# Altium schematic sheet ShiftregisterTeil1.SchDoc
size A4
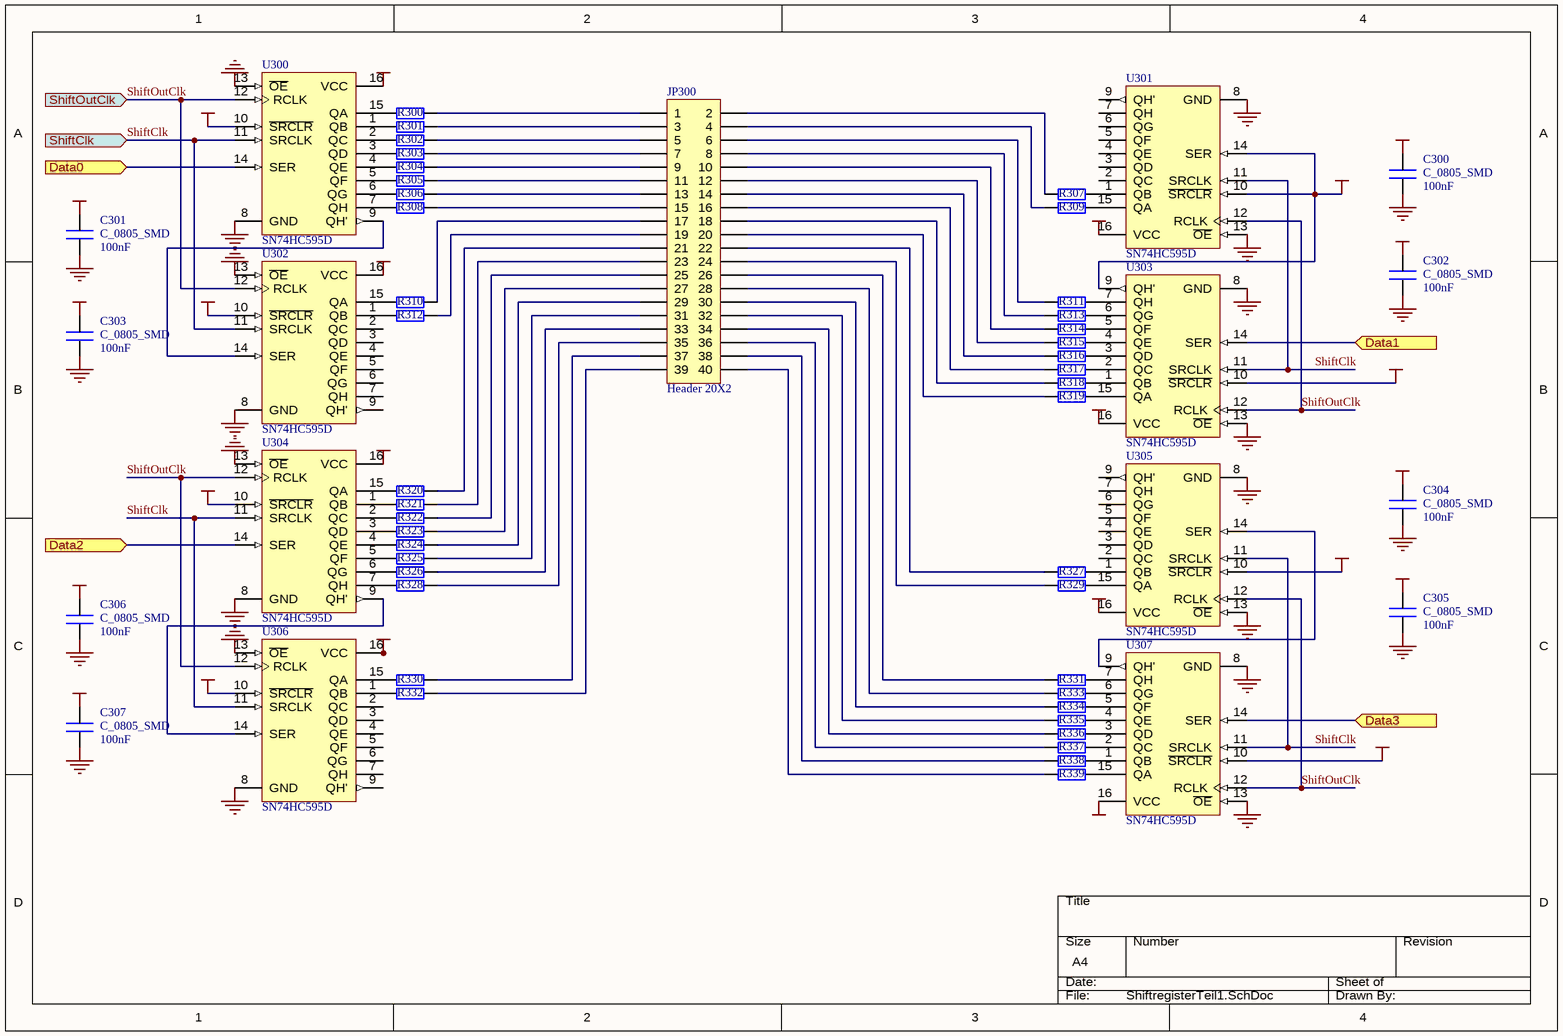
[diagram p0: ShiftregisterTeil1.SchDoc]

## Parts
C300  C_0805_SMD  [0805_R]
C301  C_0805_SMD  [0805_R]
C302  C_0805_SMD  [0805_R]
C303  C_0805_SMD  [0805_R]
C304  C_0805_SMD  [0805_R]
C305  C_0805_SMD  [0805_R]
C306  C_0805_SMD  [0805_R]
C307  C_0805_SMD  [0805_R]
JP300  Header 20X2  [HDR2X20]
R300  PullUp  [CR2012-0805]  (value not drawn)
R301  PullUp  [CR2012-0805]  (value not drawn)
R302  PullUp  [CR2012-0805]  (value not drawn)
R303  PullUp  [CR2012-0805]  (value not drawn)
R304  PullUp  [CR2012-0805]  (value not drawn)
R305  PullUp  [CR2012-0805]  (value not drawn)
R306  PullUp  [CR2012-0805]  (value not drawn)
R307  PullUp  [CR2012-0805]  (value not drawn)
R308  PullUp  [CR2012-0805]  (value not drawn)
R309  PullUp  [CR2012-0805]  (value not drawn)
R310  PullUp  [CR2012-0805]  (value not drawn)
R311  PullUp  [CR2012-0805]  (value not drawn)
R312  PullUp  [CR2012-0805]  (value not drawn)
R313  PullUp  [CR2012-0805]  (value not drawn)
R314  PullUp  [CR2012-0805]  (value not drawn)
R315  PullUp  [CR2012-0805]  (value not drawn)
R316  PullUp  [CR2012-0805]  (value not drawn)
R317  PullUp  [CR2012-0805]  (value not drawn)
R318  PullUp  [CR2012-0805]  (value not drawn)
R319  PullUp  [CR2012-0805]  (value not drawn)
R320  PullUp  [CR2012-0805]  (value not drawn)
R321  PullUp  [CR2012-0805]  (value not drawn)
R322  PullUp  [CR2012-0805]  (value not drawn)
R323  PullUp  [CR2012-0805]  (value not drawn)
R324  PullUp  [CR2012-0805]  (value not drawn)
R325  PullUp  [CR2012-0805]  (value not drawn)
R326  PullUp  [CR2012-0805]  (value not drawn)
R327  PullUp  [CR2012-0805]  (value not drawn)
R328  PullUp  [CR2012-0805]  (value not drawn)
R329  PullUp  [CR2012-0805]  (value not drawn)
R330  PullUp  [CR2012-0805]  (value not drawn)
R331  PullUp  [CR2012-0805]  (value not drawn)
R332  PullUp  [CR2012-0805]  (value not drawn)
R333  PullUp  [CR2012-0805]  (value not drawn)
R334  PullUp  [CR2012-0805]  (value not drawn)
R335  PullUp  [CR2012-0805]  (value not drawn)
R336  PullUp  [CR2012-0805]  (value not drawn)
R337  PullUp  [CR2012-0805]  (value not drawn)
R338  PullUp  [CR2012-0805]  (value not drawn)
R339  PullUp  [CR2012-0805]  (value not drawn)
U300  SN74HC595D  [D016]
U301  SN74HC595D  [D016]
U302  SN74HC595D  [D016]
U303  SN74HC595D  [D016]
U304  SN74HC595D  [D016]
U305  SN74HC595D  [D016]
U306  SN74HC595D  [D016]
U307  SN74HC595D  [D016]

## Ports
Data0 (in), Data1 (in), Data2 (in), Data3 (in), ShiftClk (in), ShiftOutClk (in)

## Nets
GND: C300.1 C301.1 C302.1 C303.1 C304.1 C305.1 C306.1 C307.1 U300.8(GND) U300.13(~{OE}) U301.8(GND) U301.13(~{OE}) U302.8(GND) U302.13(~{OE}) U303.8(GND) U303.13(~{OE}) U304.8(GND) U304.13(~{OE}) U305.8(GND) U305.13(~{OE}) U306.8(GND) U306.13(~{OE}) U307.8(GND) U307.13(~{OE})
VCC: C300.2 C301.2 C302.2 C303.2 C304.2 C305.2 C306.2 C307.2 U300.10(~{SRCLR}) U300.16(VCC) U301.10(~{SRCLR}) U301.14(SER) U301.16(VCC) U302.10(~{SRCLR}) U302.16(VCC) U303.9(QH') U303.10(~{SRCLR}) U303.16(VCC) U304.10(~{SRCLR}) U304.16(VCC) U305.10(~{SRCLR}) U305.16(VCC) U306.10(~{SRCLR}) U306.16(VCC) U307.10(~{SRCLR}) U307.16(VCC)
Data0: U300.14(SER) ; port Data0
Data1: U303.14(SER) ; port Data1
Data2: U304.14(SER) ; port Data2
Data3: U307.14(SER) ; port Data3
ShiftClk: U300.11(SRCLK) U301.11(SRCLK) U302.11(SRCLK) U303.11(SRCLK) U304.11(SRCLK) U305.11(SRCLK) U306.11(SRCLK) U307.11(SRCLK) ; port ShiftClk
ShiftOutClk: U300.12(RCLK) U301.12(RCLK) U302.12(RCLK) U303.12(RCLK) U304.12(RCLK) U305.12(RCLK) U306.12(RCLK) U307.12(RCLK) ; port ShiftOutClk
NetJP300_1: JP300.1 R300.1
NetJP300_2: JP300.2 R307.2
NetJP300_3: JP300.3 R301.1
NetJP300_4: JP300.4 R309.2
NetJP300_5: JP300.5 R302.1
NetJP300_6: JP300.6 R311.2
NetJP300_7: JP300.7 R303.1
NetJP300_8: JP300.8 R313.2
NetJP300_9: JP300.9 R304.1
NetJP300_10: JP300.10 R314.2
NetJP300_11: JP300.11 R305.1
NetJP300_12: JP300.12 R315.2
NetJP300_13: JP300.13 R306.1
NetJP300_14: JP300.14 R316.2
NetJP300_15: JP300.15 R308.1
NetJP300_16: JP300.16 R317.2
NetJP300_17: JP300.17 R310.1
NetJP300_18: JP300.18 R318.2
NetJP300_19: JP300.19 R312.1
NetJP300_20: JP300.20 R319.2
NetJP300_21: JP300.21 R320.1
NetJP300_22: JP300.22 R327.2
NetJP300_23: JP300.23 R321.1
NetJP300_24: JP300.24 R329.2
NetJP300_25: JP300.25 R322.1
NetJP300_26: JP300.26 R331.2
NetJP300_27: JP300.27 R323.1
NetJP300_28: JP300.28 R333.2
NetJP300_29: JP300.29 R324.1
NetJP300_30: JP300.30 R334.2
NetJP300_31: JP300.31 R325.1
NetJP300_32: JP300.32 R335.2
NetJP300_33: JP300.33 R326.1
NetJP300_34: JP300.34 R336.2
NetJP300_35: JP300.35 R328.1
NetJP300_36: JP300.36 R337.2
NetJP300_37: JP300.37 R330.1
NetJP300_38: JP300.38 R338.2
NetJP300_39: JP300.39 R332.1
NetJP300_40: JP300.40 R339.2
NetR300_2: R300.2 U300.15(QA)
NetR301_2: R301.2 U300.1(QB)
NetR302_2: R302.2 U300.2(QC)
NetR303_2: R303.2 U300.3(QD)
NetR304_2: R304.2 U300.4(QE)
NetR305_2: R305.2 U300.5(QF)
NetR306_2: R306.2 U300.6(QG)
NetR307_1: R307.1 U301.1(QB)
NetR308_2: R308.2 U300.7(QH)
NetR309_1: R309.1 U301.15(QA)
NetR310_2: R310.2 U302.15(QA)
NetR311_1: R311.1 U303.7(QH)
NetR312_2: R312.2 U302.1(QB)
NetR313_1: R313.1 U303.6(QG)
NetR314_1: R314.1 U303.5(QF)
NetR315_1: R315.1 U303.4(QE)
NetR316_1: R316.1 U303.3(QD)
NetR317_1: R317.1 U303.2(QC)
NetR318_1: R318.1 U303.1(QB)
NetR319_1: R319.1 U303.15(QA)
NetR320_2: R320.2 U304.15(QA)
NetR321_2: R321.2 U304.1(QB)
NetR322_2: R322.2 U304.2(QC)
NetR323_2: R323.2 U304.3(QD)
NetR324_2: R324.2 U304.4(QE)
NetR325_2: R325.2 U304.5(QF)
NetR326_2: R326.2 U304.6(QG)
NetR327_1: R327.1 U305.1(QB)
NetR328_2: R328.2 U304.7(QH)
NetR329_1: R329.1 U305.15(QA)
NetR330_2: R330.2 U306.15(QA)
NetR331_1: R331.1 U307.7(QH)
NetR332_2: R332.2 U306.1(QB)
NetR333_1: R333.1 U307.6(QG)
NetR334_1: R334.1 U307.5(QF)
NetR335_1: R335.1 U307.4(QE)
NetR336_1: R336.1 U307.3(QD)
NetR337_1: R337.1 U307.2(QC)
NetR338_1: R338.1 U307.1(QB)
NetR339_1: R339.1 U307.15(QA)
NetU300_9: U300.9(QH') U302.14(SER)
NetU304_9: U304.9(QH') U306.14(SER)
NetU305_14: U305.14(SER) U307.9(QH')

Not connected (* = marked no-connect by the designer): U301 2(QC) 3(QD) 4(QE) 5(QF) 6(QG) 7(QH) 9(QH'); U302 2(QC) 3(QD) 4(QE) 5(QF) 6(QG) 7(QH) 9(QH'); U305 2(QC) 3(QD) 4(QE) 5(QF) 6(QG) 7(QH) 9(QH'); U306 2(QC) 3(QD) 4(QE) 5(QF) 6(QG) 7(QH) 9(QH')

## Notes on the sheet
- (in symbol C_0805_SMD) 100nF

## Library data of the parts
C300-C307 = C_0805_SMD: Kondensator in SMD-Bauform
JP300 = Header 20X2: Header, 20-Pin, Dual row; Revision: 17-Jul-2002: Re-released for DXP Platform.; Publisher: Altium Limited
R300-R339 = Res2: Resistor; Value: 10K; Published: 8-Jun-2000; Revision: July-2002: Re-released for DXP Platform.; Publisher: Altium Limited
U300-U307 = SN74HC595D: 8-Bit Shift Register with 3-State Output Registers; Package Information: Latest Revision: Jan-1998; Published: 8-Jun-2000; Revision: 17-Jul-2002: Re-released for DXP Platform.; Datasheet: Latest Revision: May-1997; Package Reference: D016; Publisher: Altium Limited